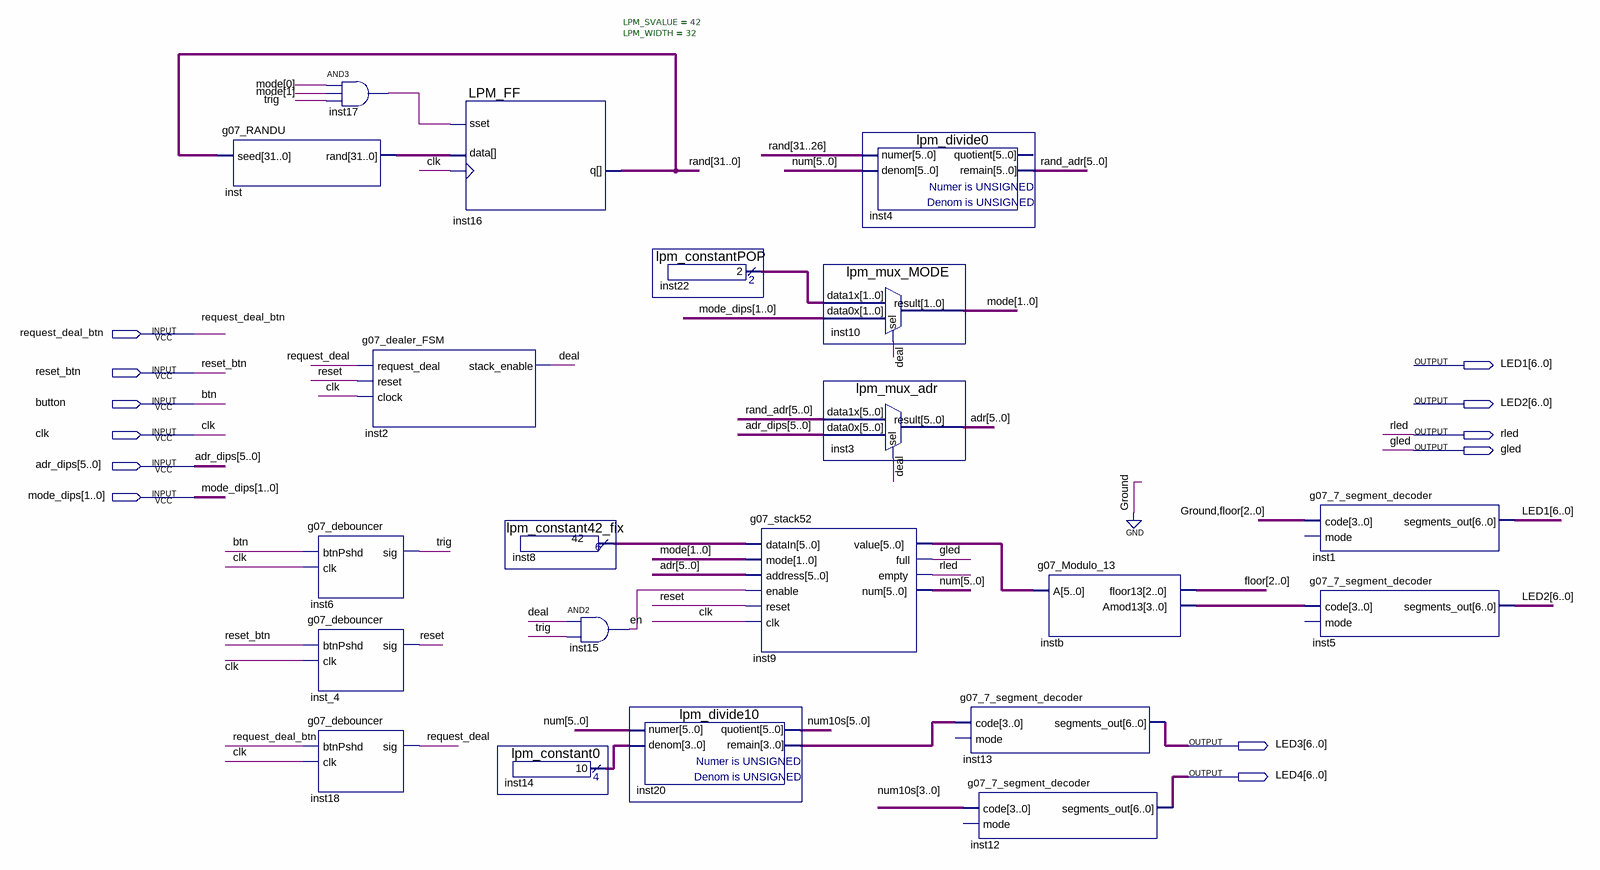
[diagram p0: schematic sheet]
// Quartus schematic g07_lab4_testbed.bdf as structural Verilog: 21 symbols, 12 pins
module g07_lab4_testbed (
  input  request_deal_btn,
  input  reset_btn,
  input  button,
  input  clk,
  input  [5:0] adr_dips,
  input  [1:0] mode_dips,
  output [6:0] LED1,
  output [6:0] LED2,
  output rled,
  output gled,
  output [6:0] LED3,
  output [6:0] LED4
);

  wire deal, en, inst17_out, request_deal, reset, trig;
  wire [1:0] inst22_result, mode;
  wire [2:0] floor;
  wire [3:0] inst14_result, inst20_remain, instb_amod13;
  wire [5:0] adr, inst8_result, inst9_value, num, num10s, rand_adr;
  wire [31:0] inst_rand, \rand ;

  g07_RANDU inst (.seed(\rand ), .\rand (inst_rand));
  g07_debouncer inst6 (.btnPshd(button), .clk(clk), .sig(trig));
  g07_debouncer inst_4 (.btnPshd(reset_btn), .clk(clk), .sig(reset));
  g07_debouncer inst18 (.btnPshd(request_deal_btn), .clk(clk), .sig(request_deal));
  and inst17 (inst17_out, mode[0], mode[1], trig);
  g07_dealer_FSM inst2 (.request_deal(request_deal), .reset(reset), .clock(clk), .stack_enable(deal));
  LPM_FF #(.LPM_SVALUE(42), .LPM_WIDTH(32)) inst16 (.clock(clk), .data(inst_rand), .sset(inst17_out), .q(\rand ));
  lpm_constant42_fix inst8 (.result(inst8_result));
  lpm_constant0 inst14 (.result(inst14_result));
  and inst15 (en, deal, trig);
  lpm_constantPOP inst22 (.result(inst22_result));
  lpm_divide10 inst20 (.numer(num), .denom(inst14_result), .quotient(num10s), .remain(inst20_remain));
  g07_stack52 inst9 (
    .dataIn(inst8_result), .mode(mode), .address(adr), .enable(en), .reset(reset), .clk(clk),
    .value(inst9_value), .full(gled), .empty(rled), .num(num));
  lpm_divide0 inst4 (.numer(\rand [31:26]), .denom(num), .remain(rand_adr));  // open: quotient
  lpm_mux_MODE inst10 (.data1x(inst22_result), .data0x(mode_dips), .sel(deal), .result(mode));
  lpm_mux_adr inst3 (.data1x(rand_adr), .data0x(adr_dips), .sel(deal), .result(adr));
  g07_7_segment_decoder inst13 (.code(inst20_remain), .segments_out(LED3));  // open: mode
  g07_7_segment_decoder inst12 (.code(num10s[3:0]), .segments_out(LED4));  // open: mode
  g07_Modulo_13 instb (.A(inst9_value), .floor13(floor), .Amod13(instb_amod13));
  g07_7_segment_decoder inst1 (.code({1'b0, floor}), .segments_out(LED1));  // open: mode
  g07_7_segment_decoder inst5 (.code(instb_amod13), .segments_out(LED2));  // open: mode

  // Other names for the same wires on the sheet: btn = button
endmodule
